# EAGLE design Step_Down_Module (EAGLE 9.2.2)
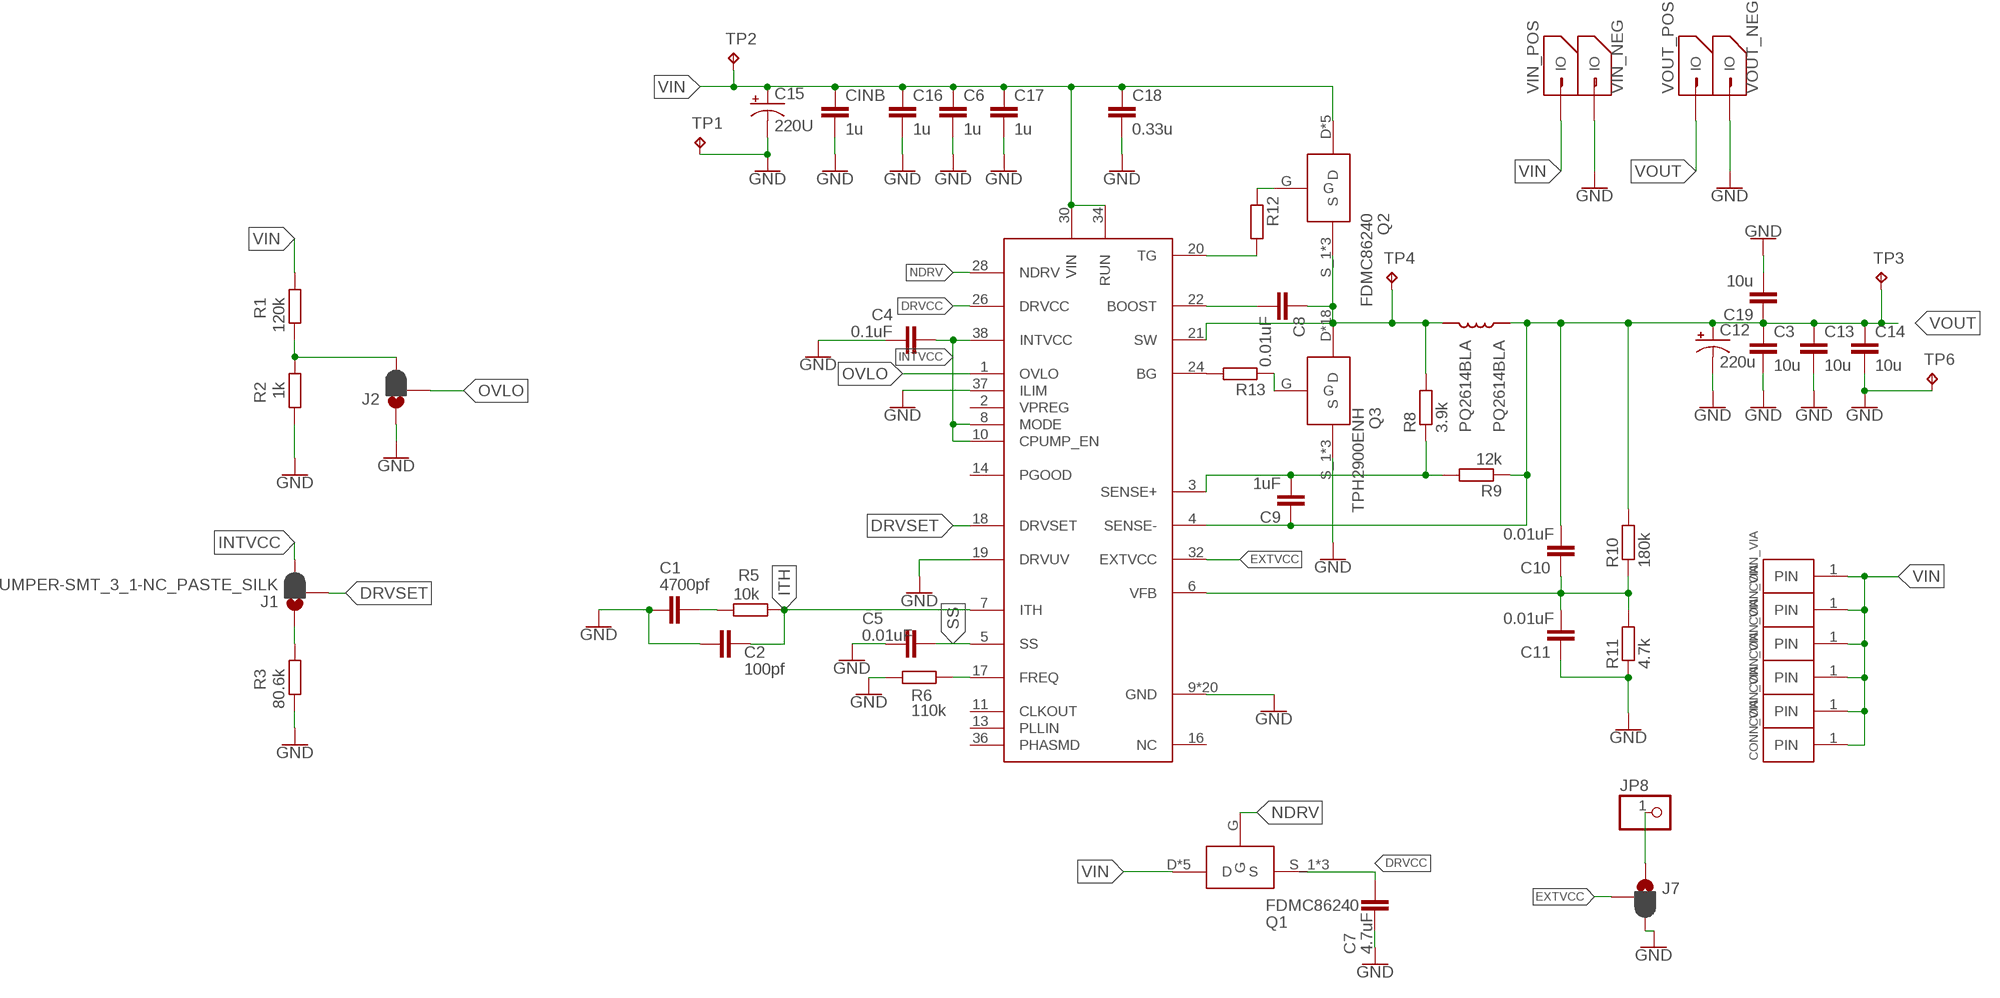
[diagram p0: schematic, sheet 1]

## Parts
C1  4700pf  C-EUC0805  [C0805]
C2  100pf  C-EUC0805  [C0805]
C3  10u  CAP_SMD_1210  [1210]
C4  0.1uF  C-EUC0805  [C0805]
C5  0.01uF  C-EUC0805  [C0805]
C6  1u  C-EUC2220K  [C2220K]
C7  4.7uF  C-EUC0805  [C0805]
C8  0.01uF  C-EUC0805  [C0805]
C9  1uF  C-EUC0805  [C0805]
C10  0.01uF  C-EUC0805  [C0805]
C11  0.01uF  C-EUC0805  [C0805]
C12  220u  1000UF-RADIAL-5MM-25V-20%  [CPOL-RADIAL-5MM-10MM]
C13  10u  CAP_SMD_1210  [1210]
C14  10u  CAP_SMD_1210  [1210]
C15  220U  [CPOL-RADIAL-7.5MM-18MM]
C16  1u  C-EUC2220K  [C2220K]
C17  1u  C-EUC2220K  [C2220K]
C18  0.33u  C-EUC1812  [C1812]
C19  10u  CAP_SMD_1210  [1210]
CINB  1u  C-EUC2220K  [C2220K]
J1  JUMPER-SMT_3_1-NC_PASTE_SILK  [SMT-JUMPER_3_1-NC_PASTE_SILK]
J2  JUMPER-SMT_3_1-NC_PASTE_SILK  [SMT-JUMPER_3_1-NC_PASTE_SILK]
J7  JUMPER-SMT_3_1-NC_PASTE_SILK  [SMT-JUMPER_3_1-NC_PASTE_SILK]
JP8  PINHD-1X1  [1X01]
L1  PQ2614BLA  [PQ2614BLA]
Q1  FDMC86240  [8-MLP/POWERWFDN]
Q2  FDMC86240  [8-MLP/POWERWFDN]
Q3  TPH2900ENH  [SOP_ADVANCE]
R1  120k  R-EU_R0805  [R0805]
R2  1k  R-EU_R0805  [R0805]
R3  80.6k  R-EU_R0805  [R0805]
R5  10k  R-EU_R0805  [R0805]
R6  110k  R-EU_R0805  [R0805]
R8  3.9k  R-EU_0204/5  [0204/5]
R9  12k  R-EU_0204/5  [0204/5]
R10  180k  R-EU_R0805  [R0805]
R11  4.7k  R-EU_R0805  [R0805]
R12  R-EU_R0805  [R0805]
R13  R-EU_R0805  [R0805]
TP1  TPTP16R  [TP16R]
TP2  TPTP16R  [TP16R]
TP3  TPTP16R  [TP16R]
TP4  TPTP16R  [TP16R]
TP6  TPTP16R  [TP16R]
U1  LTC3895_STEP_DOWN_DC-DC_CONVERTERSMD_TSSOP  [38_LEAD_TSSOP(FE38)]
U$1  CONN_VIA  [CONN_VIA]
U$2  CONN_VIA  [CONN_VIA]
U$3  CONN_VIA  [CONN_VIA]
U$4  CONN_VIA  [CONN_VIA]
U$5  CONN_VIA  [CONN_VIA]
U$6  CONN_VIA  [CONN_VIA]
VIN_NEG  IO_PAD_SINGLE  [IO_SINGLE]
VIN_POS  IO_PAD_SINGLE  [IO_SINGLE]
VOUT_NEG  IO_PAD_SINGLE  [IO_SINGLE]
VOUT_POS  IO_PAD_SINGLE  [IO_SINGLE]

## Nets
BOOST: C8.2 U1.22(BOOST)
DRVCC: C7.1 Q1.S_1(S) Q1.S_2(S) Q1.S_3(S) U1.26(DRVCC)
DRVSET: J1.2 U1.18(DRVSET)
EXTVCC: J7.2 U1.32(EXTVCC)
FREQ: R6.2 U1.17(FREQ)
G2: R12.2 U1.20(TG)
G3: R13.2 U1.24(BG)
GND: C1.2 C2.2 C3.2 C4.1 C5.2 C6.2 C7.2 C11.1 C12.- C13.2 C14.2 C15.- C16.2 C17.2 C18.2 C19.2 CINB.2 J2.1 J7.3 Q3.S_1(S) Q3.S_2(S) Q3.S_3(S) R2.2 R3.2 R6.1 R11.1 TP1.TP TP6.TP U1.9(GND) U1.12(GND) U1.15(GND) U1.19(DRVUV) U1.37(ILIM) U1.39(GND) U1.39_B(GND) U1.PWR_PAD1(GND) U1.PWR_PAD2(GND) U1.PWR_PAD3(GND) U1.PWR_PAD4(GND) U1.PWR_PAD5(GND) U1.PWR_PAD6(GND) U1.PWR_PAD7(GND) U1.PWR_PAD8(GND) U1.PWR_PAD9(GND) U1.PWR_PAD10(GND) U1.PWR_PAD11(GND) U1.PWR_PAD12(GND) U1.PWR_PAD13(GND) U1.PWR_PAD14(GND) U1.PWR_PAD15(GND) VIN_NEG.1(IO) VIN_NEG.2(IO) VIN_NEG.3(IO) VIN_NEG.4(IO) VIN_NEG.5(IO) VIN_NEG.6(IO) VIN_NEG.7(IO) VIN_NEG.8(IO) VIN_NEG.9(IO) VIN_NEG.10(IO) VIN_NEG.11(IO) VIN_NEG.12(IO) VIN_NEG.13(IO) VIN_NEG.14(IO) VIN_NEG.15(IO) VIN_NEG.16(IO) VIN_NEG.17(IO) VIN_NEG.18(IO) VIN_NEG.19(IO) VIN_NEG.20(IO) VIN_NEG.IO1(IO) VIN_NEG.IO2(IO) VOUT_NEG.1(IO) VOUT_NEG.2(IO) VOUT_NEG.3(IO) VOUT_NEG.4(IO) VOUT_NEG.5(IO) VOUT_NEG.6(IO) VOUT_NEG.7(IO) VOUT_NEG.8(IO) VOUT_NEG.9(IO) VOUT_NEG.10(IO) VOUT_NEG.11(IO) VOUT_NEG.12(IO) VOUT_NEG.13(IO) VOUT_NEG.14(IO) VOUT_NEG.15(IO) VOUT_NEG.16(IO) VOUT_NEG.17(IO) VOUT_NEG.18(IO) VOUT_NEG.19(IO) VOUT_NEG.20(IO) VOUT_NEG.IO1(IO) VOUT_NEG.IO2(IO)
INTVCC: C4.2 J1.3 U1.8(MODE) U1.10(CPUMP_EN) U1.38(INTVCC)
ITH: C2.1 R5.1 U1.7(ITH)
N$2: Q2.G R12.1
N$3: Q3.G R13.1
N$5: J1.1 R3.1
N$9: J2.3 R1.2 R2.1
N$12: C1.1 R5.2
N$13: J7.1 JP8.1
NDRV: Q1.G U1.28(NDRV)
OVLO: J2.2 U1.1(OVLO)
S+: C9.2 R8.1 R9.2 U1.3(SENSE+)
SS: C5.1 U1.5(SS)
SW: C8.1 L1.P1 Q2.S_1(S) Q2.S_2(S) Q2.S_3(S) Q3.D Q3.D1(D) Q3.D_1(D) Q3.D_2(D) Q3.D_3(D) Q3.D_4(D) Q3.PWR_PAD1(D) Q3.PWR_PAD2(D) Q3.PWR_PAD3(D) Q3.PWR_PAD4(D) Q3.PWR_PAD5(D) Q3.PWR_PAD6(D) Q3.PWR_PAD7(D) Q3.PWR_PAD8(D) Q3.PWR_PAD9(D) Q3.PWR_PAD10(D) Q3.PWR_PAD11(D) Q3.PWR_PAD12(D) R8.2 TP4.TP U1.21(SW)
VFB: C10.1 C11.2 R10.1 R11.2 U1.6(VFB)
VIN: C6.1 C15.+ C16.1 C17.1 C18.1 CINB.1 Q1.D Q1.D_1(D) Q1.D_2(D) Q1.D_3(D) Q1.D_4(D) Q2.D Q2.D_1(D) Q2.D_2(D) Q2.D_3(D) Q2.D_4(D) R1.1 TP2.TP U1.30(VIN) U1.34(RUN) U$1.1(PIN) U$2.1(PIN) U$3.1(PIN) U$4.1(PIN) U$5.1(PIN) U$6.1(PIN) VIN_POS.1(IO) VIN_POS.2(IO) VIN_POS.3(IO) VIN_POS.4(IO) VIN_POS.5(IO) VIN_POS.6(IO) VIN_POS.7(IO) VIN_POS.8(IO) VIN_POS.9(IO) VIN_POS.10(IO) VIN_POS.11(IO) VIN_POS.12(IO) VIN_POS.13(IO) VIN_POS.14(IO) VIN_POS.15(IO) VIN_POS.16(IO) VIN_POS.17(IO) VIN_POS.18(IO) VIN_POS.19(IO) VIN_POS.20(IO) VIN_POS.IO1(IO) VIN_POS.IO2(IO)
VOUT: C3.1 C9.1 C10.2 C12.+ C13.1 C14.1 C19.1 L1.P2 R9.1 R10.2 TP3.TP U1.4(SENSE-) VOUT_POS.1(IO) VOUT_POS.2(IO) VOUT_POS.3(IO) VOUT_POS.4(IO) VOUT_POS.5(IO) VOUT_POS.6(IO) VOUT_POS.7(IO) VOUT_POS.8(IO) VOUT_POS.9(IO) VOUT_POS.10(IO) VOUT_POS.11(IO) VOUT_POS.12(IO) VOUT_POS.13(IO) VOUT_POS.14(IO) VOUT_POS.15(IO) VOUT_POS.16(IO) VOUT_POS.17(IO) VOUT_POS.18(IO) VOUT_POS.19(IO) VOUT_POS.20(IO) VOUT_POS.IO1(IO) VOUT_POS.IO2(IO)
Unconnected: U1.2(VPREG) U1.11(CLKOUT) U1.13(PLLIN) U1.14(PGOOD) U1.16(NC) U1.36(PHASMD)

## Library data of the parts
C1 C2 C4-C11 C16-C18 CINB = rcl:C-EU: CAPACITOR, European symbol; SPICEPREFIX: C
C3 C13 C14 C19 = SparkFun-Capacitors:CAP_SMD_1210
C12 = SparkFun-Capacitors:1000UF: 1,000µF/1mF ceramic capacitors A capacitor is a passive two-terminal electrical component used to store electrical energy temporarily in an electric field. CAP-08070; PROD_ID: CAP-09538; VALUE: 1mF
C15 = SparkFun-Capacitors:220U
J1 J2 J7 = SparkFun-Jumpers:JUMPER-SMT_3_1-NC_PASTE: Normally closed solder jumper (1 of 2 connections) This jumper has an aperture in the stencil to allow solder paste to bridge one of the two connections. One connection is normally closed (NC), while the other is normally open (NO). Wick off the solder to open the connection. Reapply solder to reclose the connection. Apply solder to the other side instead to change the current path.
JP8 = pinhead:PINHD-1X1: PIN HEADER
L1 = Inductors:PQ2614BLA
Q1 Q2 = Switching_MOS:FDMC86240
Q3 = Switching_MOS:TPH2900ENH: MOSFET N-Ch 100V 32A 19ns U-MOS SOP8 Adv Toshiba TPH8R80ANH N-channel MOSFET Transistor, 59 A, 100 V, 8-Pin SOP Advanced Source: Datasheet <https://toshiba.semicon-storage.com/info/docget.jsp?did=12776&prodName=TPH8R80ANH>; DESCRIPTION: MOSFET N-Ch 100V 32A 19ns U-MOS SOP8 Adv Toshiba TPH8R80ANH N-channel MOSFET Transistor, 59 A, 100 V, 8-Pin SOP Advanced; HEIGHT: mm; MANUFACTURER_NAME: Toshiba; MANUFACTURER_PART_NUMBER: TPH8R80ANH; MOUSER_PART_NUMBER: 1687790; MOUSER_PRICE-STOCK: http://uk.rs-online.com/web/p/products/1687790; RS_PART_NUMBER: 1687790; RS_PRICE-STOCK: http://uk.rs-online.com/web/p/products/1687790; SPICEPREFIX: Q
R1-R3 R5 R6 R10-R13 = rcl:R-EU_: RESISTOR, European symbol; SPICEPREFIX: R
R8 R9 = resistor:R-EU_: RESISTOR, European symbol
TP1-TP4 TP6 = testpad:TP: Test pad
U1 = LTC3895:LTC3895_STEP_DOWN_DC-DC_CONVERTER
U$1-U$6 = IO_pad:CONN_VIA
VIN_NEG VIN_POS VOUT_NEG VOUT_POS = IO_pad:IO_PAD_SINGLE

## Board
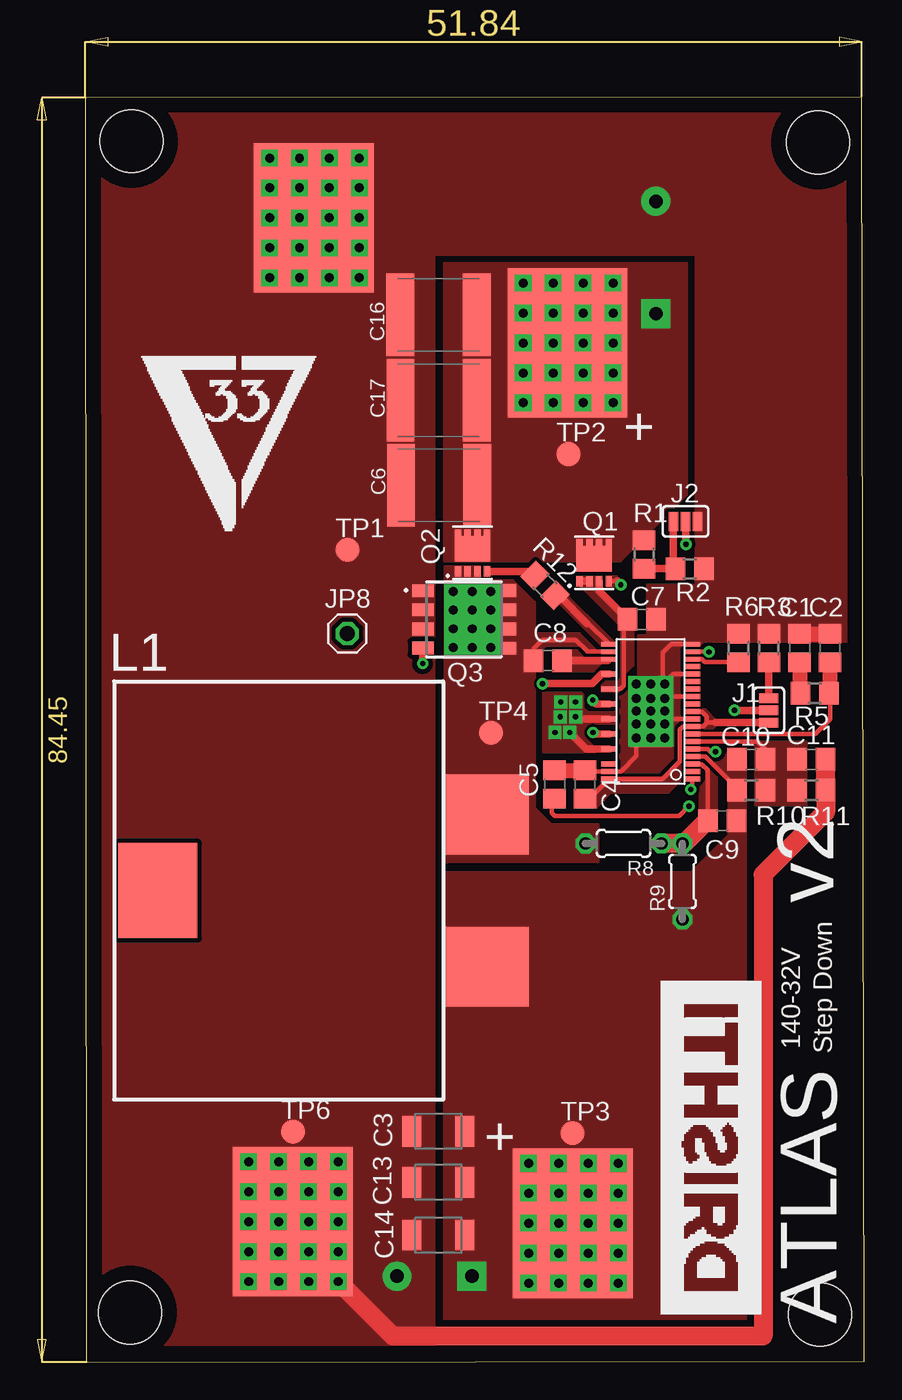
[diagram p1: board, top side]
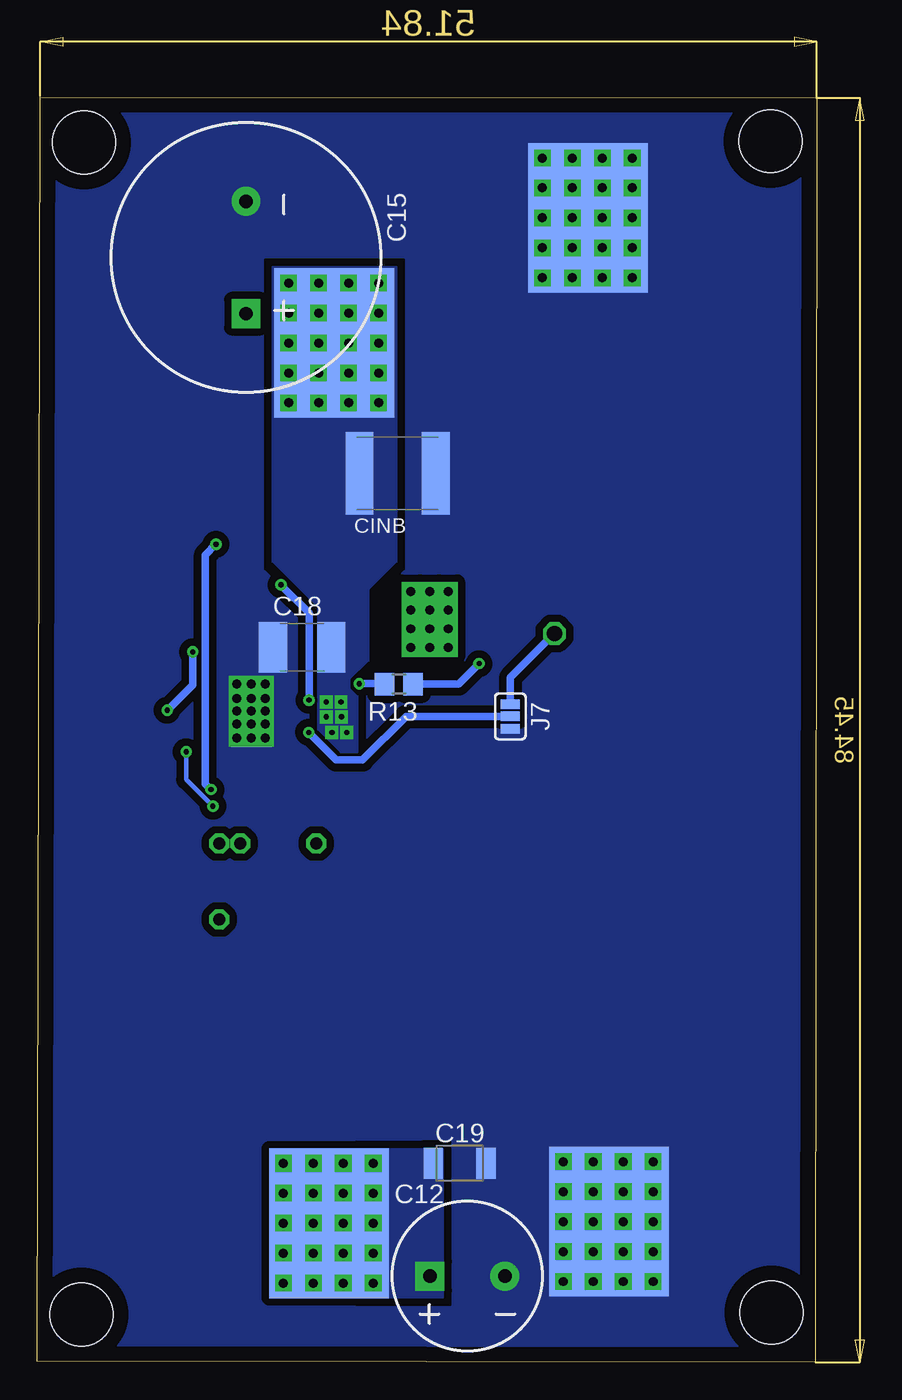
[diagram p2: board, bottom side, seen from below]

Size 52.02 x 84.51 mm. Coordinates in mm from the lower left corner, seen from the top.
Outline: 0.08,0 52.02,0.05 51.84,84.51 0,84.45 0.08,0
Copper layers (1*16): Top 0.035mm / dielectric 1.5mm / Bottom 0.035mm
Design rules "default *": minimum track width 6mil, minimum drill 0.35mm, track to track 7mil, track to pad 6mil, pad to pad 6mil, via to via 6mil, smd to smd 6mil, copper to edge 40mil, drill to drill 6mil, minimum pad ring 10mil, minimum via ring 8mil, stop-mask expansion 4mil, vias tented up to drill 0mil, thermal gap 10mil
Holes 4.2 mm at 3.07,81.56 48.92,81.48 3,3.3 49.07,3.17

### Footprints (pad centres in the part's own frame; a part is rotated, then mirrored left to right if it is on the bottom)
C0805 = smd 1.3 x 1.5: 1 -0.95,0; 2 0.95,0
1210 = smd 1.27 x 2.06: 1 -1.755,0; 2 1.755,0
C2220K = smd 1.85 x 5.5: 1 -2.55,0; 2 2.55,0
CPOL-RADIAL-5MM-10MM = drill 0.9 pad 1.93 square: + 2.5,0 | drill 0.9 pad 1.93: - -2.5,0
CPOL-RADIAL-7.5MM-18MM = drill 0.9 pad 1.93 square: + 3.75,0 | drill 0.9 pad 1.93: - -3.75,0
C1812 = smd 1.9 x 3.4: 1 -1.95,0; 2 1.95,0
SMT-JUMPER_3_1-NC_PASTE_SILK = smd 0.635 x 1.27: 1 -0.813,0; 2 0,0; 3 0.813,0
1X01 = drill 1.016 octagon: 1 0,0
PQ2614BLA = smd 6.35 x 5.28: MOUNT 0,7.62 | smd 5.33 x 5.59: P1 5.08,-14.351; P2 -5.08,-14.351
8-MLP/POWERWFDN = smd 2.37 x 1.7: D 0,0.45 | smd 0.42 x 0.45: D_1 0.975,1.525; D_2 0.325,1.525; D_3 -0.325,1.525; D_4 -0.975,1.525 | smd 0.42 x 0.7: G 0.975,-1.05; S_1 -0.975,-1.05; S_2 -0.325,-1.05; S_3 0.325,-1.05
SOP_ADVANCE = smd 4.7 x 3.75: D 1.875,1.255 | smd 4.7 x 3.75 bottom: D1 1.874,1.25 | smd 0.85 x 1.05: D_1 3.8,3.655; D_2 2.51,3.655; D_3 1.24,3.655; D_4 -0.05,3.655 | smd 0.85 x 1.45: G 3.78,-2.045; S_1 -0.03,-2.045; S_2 1.24,-2.045; S_3 2.51,-2.045 | drill 0.6 pad 1.25 square: PWR_PAD1 0,0; PWR_PAD2 0,1.25; PWR_PAD3 0,2.5; PWR_PAD4 1.25,0; PWR_PAD5 1.25,1.25; PWR_PAD6 1.25,2.5; PWR_PAD7 2.5,0; PWR_PAD8 2.5,1.25; PWR_PAD9 2.5,2.5; PWR_PAD10 3.75,0; PWR_PAD11 3.75,1.25; PWR_PAD12 3.75,2.5
R0805 = smd 1.3 x 1.5: 1 -0.95,0; 2 0.95,0
0204/5 = drill 0.813 octagon: 1 -2.54,0; 2 2.54,0
TP16R = smd 1.6 x 1.6: TP 0,0
38_LEAD_TSSOP(FE38) = smd 0.315 x 1.05: 1 0.35,-0.525; 2 0.85,-0.525; 3 1.35,-0.525; 4 1.85,-0.525; 5 2.35,-0.525; 6 2.85,-0.525; 7 3.35,-0.525; 8 3.85,-0.525; 9 4.35,-0.525; 10 4.85,-0.525; 11 5.35,-0.525; 12 5.85,-0.525; 13 6.35,-0.525; 14 6.85,-0.525; 15 7.35,-0.525; 16 7.85,-0.525; 17 8.35,-0.525; 18 8.85,-0.525; 19 9.35,-0.525; 20 9.35,5.025; 21 8.85,5.025; 22 8.35,5.025; 24 7.35,5.025; 26 6.35,5.025; 28 5.35,5.025; 30 4.35,5.025; 32 3.35,5.025; 34 2.35,5.025; 36 1.35,5.025; 37 0.85,5.025; 38 0.35,5.025 | smd 4.75 x 2.74: 39 4.85,2.25 | smd 4.75 x 2.74 bottom: 39_B 4.85,2.25 | drill 0.6 pad 0.75 square: PWR_PAD1 3.075,1.3; PWR_PAD2 3.075,2.25; PWR_PAD3 3.075,3.2; PWR_PAD4 4.025,1.3; PWR_PAD5 4.025,2.25; PWR_PAD6 4.025,3.2; PWR_PAD7 4.875,1.3; PWR_PAD8 4.875,2.25; PWR_PAD9 4.875,3.2; PWR_PAD10 5.725,1.3; PWR_PAD11 5.725,2.25; PWR_PAD12 5.725,3.2; PWR_PAD13 6.675,1.3; PWR_PAD14 6.675,2.25; PWR_PAD15 6.675,3.2
CONN_VIA = drill 0.35 pad 0.61 square: 1 0,0
IO_SINGLE = drill 0.6 pad 1 square: 1 -3.063,3.525; 2 -1.063,3.525; 3 0.937,3.525; 4 2.937,3.525; 5 -3.063,1.525; 6 -1.063,1.525; 7 0.937,1.525; 8 2.937,1.525; 9 -3.063,-0.475; 10 -1.063,-0.475; 11 0.937,-0.475; 12 2.937,-0.475; 13 -3.063,-2.475; 14 -1.063,-2.475; 15 0.937,-2.475; 16 2.937,-2.475; 17 -3.063,-4.475; 18 -1.063,-4.475; 19 0.937,-4.475; 20 2.937,-4.475 | smd 8 x 10 bottom: IO1 -0.11,-0.476 | smd 8 x 10: IO2 -0.11,-0.476

### Placement (x,y rotation side)
C1  47.7,47.7 90 top
C2  49.73,47.7 90 top
C3  23.57,15.42 180 top
C4  33.38,38.58 270 top
C5  31.35,38.58 90 top
C6  23.63,58.58 180 top
C7  37.16,49.61 0 top
C8  30.89,46.86 0 top
C9  42.54,36.17 180 top
C10  44.48,40.26 180 top
C11  48.49,40.26 180 top
C12  23.32,5.74 180 bottom
C13  23.57,12.01 180 top
C14  23.57,8.48 180 top
C15  38.1,73.79 270 bottom
C16  23.59,69.96 180 top
C17  23.59,64.24 180 top
C18  34.35,47.75 180 bottom
C19  23.82,13.28 0 bottom
CINB  27.98,59.36 0 bottom
J1  45.64,43.54 270 top
J2  40.08,56.16 180 top
J7  20.45,43.13 270 bottom
JP8  17.5,48.67 0 top
L1  12.47,31.5 90 top
Q1  33.98,53.21 0 top
Q2  25.86,53.87 0 top
Q3  24.59,51.49 270 top
R1  37.31,53.95 270 top
R2  40.36,52.98 0 top
R3  45.65,47.71 90 top
R5  48.72,44.68 180 top
R6  43.62,47.71 270 top
R8  35.94,34.65 180 top
R9  39.88,32.11 90 top
R10  44.48,38.2 180 top
R11  48.49,38.2 180 top
R12  30.7,51.88 315 top
R13  27.89,45.29 180 bottom
TP1  17.5,54.25 0 top
TP2  32.26,60.66 0 top
TP3  32.54,15.29 0 top
TP4  27.08,42.04 0 top
TP6  13.87,15.39 0 top
U1  40,38.61 90 top
U$1  32.74,44.09 0 top
U$2  31.75,44.09 0 top
U$3  32.74,43.1 0 top
U$4  31.72,43.1 0 top
U$5  32.36,42.06 0 top
U$6  31.37,42.06 0 top
VIN_NEG  15.37,76.91 0 top
VIN_POS  32.31,68.55 0 top
VOUT_NEG  13.97,9.86 0 top
VOUT_POS  32.66,9.75 0 top

### Tracks (layer width: path | path; a pad name or v marks a point on that pad's centre or on a via)
BOOST
  Top 0.305: U1.22 34.89,46.86
  Top 0.508: 34.89,46.86 C8.2
  pour Top (isolate 0.152, no thermals): 32.36,47.52 32.84,47.52 33.32,47.04 34.42,47.04 34.44,47.02 34.44,46.66 33.96,46.18 32.33,46.18 32.33,47.5
DRVCC
  Top 0.305: U1.26 35.72,44.96 35.95,45.19 35.95,49.34 36.16,49.55
  Top 0.508: Q1.S_1 Q1.S_2 | 36.16,49.55 C7.1 34.31,51.51 Q1.S_3
  pour Top (no thermals): 35.79,50.29 36.6,50.29 36.6,46.53 35.79,45.72
  pour Top (no thermals): 32.87,52.45 34.47,52.45 34.47,51.61 35.81,50.27 35.81,49.07 32.97,51.92 32.89,51.92 32.87,51.94
  pour Top (no thermals): 34.49,44.78 34.49,45.19 34.75,45.44 35.51,45.44 35.79,45.72 36.02,45.72 36.02,45.21 35.59,44.78
DRVSET  (via drill 0.35)
  Top 0.305: U1.18 41.64,47.46 v41.66,47.44
  Top 0.508: v43.36,43.54 J1.2
  Bottom 0.508: v41.66,47.44 41.66,45.24 v43.36,43.54
EXTVCC  (via drill 0.35)
  Top 0.508: U1.32 34.01,41.96 v33.91,42.06
  Bottom 0.508: v33.91,42.06 32.05,40.21 30.33,40.21 27.41,43.13 J7.2
FREQ
  Top 0.305: U1.17 41.17,46.96 41.37,46.76 R6.2
G2
  Top 0.305: U1.20 33.59,49.35 33.5,49.35
  Top 0.508: R12.2 31.64,51.21 33.5,49.35
  pour Top (no thermals): 35.38,47.88 34.44,47.88 31.5,50.83 31.5,51.92 35.46,47.96
G3  (via drill 0.35)
  Top 0.508: U1.24 34.5,45.96 33.86,45.31 v30.53,45.31
  Bottom 0.508: v30.53,45.31 28.88,45.31 28.85,45.29 R13.2
GND
  Top 0.254: U1.PWR_PAD14 37.76,44.46 38.67,45.37 | U1.39_B 38.63,44.33 U1.PWR_PAD10 | U1.PWR_PAD12 36.88,44.33 U1.39_B | U1.39_B 37.73,43.48 U1.PWR_PAD9 | U1.39_B 36.93,42.63 U1.PWR_PAD6 | U1.39_B 38.58,42.63 U1.PWR_PAD4 | U1.39_B 36.8,42.51 U1.PWR_PAD3 | U1.39_B U1.PWR_PAD2 | U1.39_B U1.PWR_PAD5 U1.PWR_PAD1 | U1.39_B 38.26,42.96 38.83,42.96 | U1.39_B 36.8,44.41 U1.PWR_PAD15
  Top 0.305: U1.PWR_PAD3 36.8,40.49 35.78,39.46 U1.37 33.45,39.46 | U1.9 38.83,42.96 U1.PWR_PAD7 | U1.12 38.83,44.46 U1.PWR_PAD13 38.57,45.42 38.57,47.4 39.13,47.96 U1.19 | U1.15 39.26,45.96 38.67,45.37 | 33.45,39.46 33.22,39.46 | 33.45,39.46 C4.1
  Top 1.016: C1.2 C2.2 | C5.2 33.15,39.53 33.22,39.46
  Top 1.27: C11.1 R11.1 49.44,36.74 45.26,32.56 45.26,1.73 20.56,1.73 VOUT_NEG.20
  Bottom 0.254: U1.PWR_PAD10 38.63,44.33 U1.39_B | U1.PWR_PAD11 U1.PWR_PAD15 | U1.39_B U1.PWR_PAD11 | U1.PWR_PAD11 U1.PWR_PAD13 38.71,44.41 U1.39_B | U1.PWR_PAD11 U1.PWR_PAD14
  pour Top (isolate 0.305, no thermals): 0.66,84.18 23.29,84.18 23.29,1.17 0.66,1.17
  pour Top (isolate 0.254, no thermals): 22.88,84.18 51.46,84.18 51.46,48.16 51.49,48.13 41.33,48.13 41.05,47.85 39.78,47.85 39.78,42.9 39.27,42.39 39.27,40.36 38.33,39.42 38.33,39.4 35.74,39.4 35.74,44.42 36.93,45.62 36.93,48.54 37.52,48.54 37.52,51.87 37.54,51.89 40.74,51.89 40.77,51.92 40.77,73.96 22.88,73.96
  pour Bottom (isolate 0.508, rank 3, no thermals): -0.03,84.58 51.84,84.58 51.84,0.13 -0.03,0.13
INTVCC
  Top 0.305: U1.10 41.17,43.46 41.5,43.13 41.5,42.7 | C4.2 33.65,37.63 U1.38 38.55,38.96 39.7,40.11 39.7,42.24 39.92,42.46 U1.8 41.26,42.46 41.5,42.7 | 42.09,42.72 41.53,42.72 41.5,42.7
  Top 0.508: J1.3 42.09,42.72
  pour Top (isolate 0.152, no thermals): 38.48,39.01 39.73,40.11 39.78,40.05
  pour Top (isolate 0.152, no thermals): 41.17,43.59 41.43,43.59 42.11,42.9 42.11,42.55 41.94,42.37 41.3,42.37 41.4,42.47 41.4,43.36
  pour Top (isolate 0.152, no thermals): 33.83,38 34.49,38.66 34.49,39.04 38.51,39.04 39.57,40.11 39.8,40.11 39.8,38.89 38.96,38.05 35.13,38.05 34.14,37.06 33.83,37.06
ITH
  Top 0.305: U1.7 48.74,41.96 49.73,42.95 49.73,44.75
  Top 1.016: R5.1 49.73,44.75 C2.1
N$2
  Top 0.508: R12.1 29.76,52.82 Q2.G
N$3  (via drill 0.35)
  Top 0.508: v22.53,46.66 22.54,46.67 Q3.G
  Bottom 0.508: R13.1 23.9,45.29 v22.53,46.66
N$5
  Top 0.508: R3.1 J1.1
N$9
  Top 0.508: R1.2 39.4,53 R2.1 39.27,53.13 J2.3
N$12
  Top 1.016: C1.1 47.7,44.75 R5.2
N$13
  Bottom 0.508: JP8.1 20.45,45.72 J7.1
NDRV  (via drill 0.35)
  Top 0.305: Q1.G 35.52,52.16
  Top 0.508: U1.28 34.12,43.96 33.88,44.2 v33.88,44.22 | 35.52,52.16 v35.76,51.92
  Bottom 0.508: v35.76,51.92 33.88,50.04 v33.88,44.22
  pour Top (isolate 0.152, no thermals): 34.82,51.84 34.82,52.48 35.48,52.48 35.66,52.3 35.66,52.02 35.48,51.84
OVLO  (via drill 0.35)
  Top 0.305: v40.44,38.25 40.53,38.34 U1.1
  Top 0.508: J2.2 40.08,54.66 v40.11,54.64
  Bottom 0.508: v40.44,38.25 40.82,38.63 40.82,53.92 v40.11,54.64
S+
  Top 0.305: C9.2 41.55,36.21 41.55,39.55 41.18,39.92 40.57,39.92 U1.3
  Top 1.27: R8.1 R9.2 39.99,34.65 41.55,36.21
  pour Top (isolate 0.152, no thermals): 41.02,36.47 41.02,38.38 41.48,38.84 41.48,39.42 41.63,39.57 42.16,39.04 42.16,36.5 42.14,36.47
SS  (via drill 0.35)
  Top 0.305: C5.1 31.14,37.42 31.14,36.68 31.34,36.47 39.65,36.47 v40.31,37.14 | U1.5 40.55,40.94 41.58,40.94 41.75,40.77 v42.09,40.77
  Bottom 0.305: v42.09,40.77 42.09,38.91 v40.31,37.14
SW  (1 unrouted)
  Top 0.305: U1.21 33.54,47.46 32.77,48.23 30.5,48.23 29.94,47.67 C8.1
  pour Top (isolate 0.152, no thermals): 24,53.14 26.34,53.14 26.34,52.22 26.36,52.2 28.57,52.2 30,50.77 30,37.06 31.14,35.92 34.24,35.92 34.24,33.43 24,33.43
  pour Top (isolate 0.152, no thermals): 34.14,47.55 33.02,48.67 30.25,48.67 29.87,49.05 29.84,49.05 29.84,47.52 30.45,47.52 30.78,47.85 33.02,47.85 33.48,47.4 34.11,47.4 34.14,47.37
VFB
  Top 0.305: C10.1 45.43,40.91 44.88,41.46 U1.6
  pour Top (isolate 0.305, no thermals): 44.75,41.58 48.13,41.58 48.13,37.21 44.75,37.21
VIN
  Top 0.508: U1.30 32.89,42.96 U$3.1 | U1.34 33.46,40.96 U$5.1
  pour Top (isolate 0.152, no thermals): 30.58,44.68 33.15,44.68 33.25,44.58 33.25,43.74 33.6,43.38 35.36,43.38 35.36,42.67 33.65,42.67 33.35,42.37 33.35,41.73 34.06,41.02 34.06,40.77 30.58,40.77
  pour Top (isolate 0.254, no thermals): 23.98,73.41 40.16,73.41 40.16,57.91 35.76,53.52 23.98,53.52
  pour Bottom (isolate 0.152, no thermals): 28.07,73.15 36.3,73.15 36.3,53.47 33.27,50.44 33.27,42.27 31.77,40.77 30.68,40.77 30.66,40.79 30.66,44.48 31.19,45.01 31.19,45.62 29.95,46.86 29.95,51.61 28.07,53.49
VOUT
  Top 0.305: R10.2 43.53,38.31 41.4,40.44 40.55,40.44 U1.4
  pour Top (isolate 0.254, no thermals): 24,32.72 40.44,32.72 42.98,35.26 42.98,38.76 41.63,40.11 42.32,40.11 43.15,40.94 44.12,40.94 44.12,2.9 23.98,2.9 23.98,32.69
  pour Bottom (no thermals): 24.94,14.22 30.23,14.22 30.23,4.34 24.94,4.34

### Text on the board
tPlace: + | Q1 | Q2 | v2 | 140-32V | Step Down | ATLAS | +